# Altium schematic sheet 供电模块.SchDoc
size A4
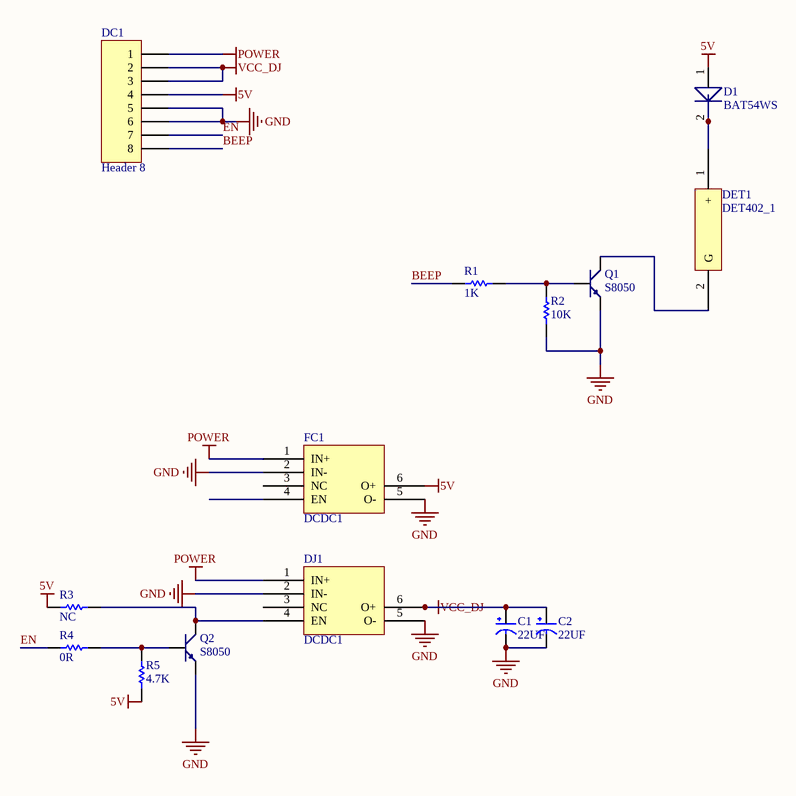
[diagram p0: 供电模块.SchDoc]

## Parts
C1  22UF  [C0603]
C2  22UF  [C0603]
D1  BAT54WS  [SOD-323]
DC1  Header 8  [HDR1X8]
DET1  DET402_1  [BEEP]
DJ1  DCDC1  [DCDC1]
FC1  DCDC1  [DCDC1]
Q1  S8050  [SOT-23R]
Q2  S8050  [SOT-23R]
R1  1K  [R0603]
R2  10K  [R0603]
R3  NC  [R0805]
R4  0R  [R0603]
R5  4.7K  [R0603]

## Nets
5V: D1.1 DC1.4 FC1.6(O+) R3.2 R5.1
GND: C1.2(GND) C2.2(GND) DC1.5 DC1.6 DJ1.2(IN-) DJ1.5(O-) FC1.2(IN-) FC1.5(O-) Q1.1(E) Q2.1(E) R2.1
POWER: DC1.1 DJ1.1(IN+) FC1.1(IN+)
VCC_DJ: C1.1(VCC) C2.1(VCC) DC1.2 DC1.3 DJ1.6(O+)
BEEP: DC1.8 R1.2
EN: DC1.7 R4.2
NetD1_2: D1.2 DET1.1(+)
NetDET1_2: DET1.2(G) Q1.3(C)
NetDJ1_4: DJ1.4(EN) Q2.3(C) R3.1
NetQ1_2: Q1.2(B) R1.1 R2.2
NetQ2_2: Q2.2(B) R4.1 R5.2

Not connected (* = marked no-connect by the designer): DJ1 3(NC); FC1 3(NC) 4(EN)

## Library data of the parts
C1 C2 = CAP1: 胆电容
D1 = BAT54: 单肖特基二极管
DC1 = Header 8: Header, 8-Pin; LatestRevisionDate: 17-Jul-2002; LatestRevisionNote: Re-released for DXP Platform.; Publisher: Altium Limited
Q1 Q2 = NPN: 8050/BCW846/BCW847
R1-R5 = Res2: 0603